# Altium schematic sheet schepc2.SchDoc
size A3; Author: *QUOCKHANH; DrawnBy: * NHÓM 17; SheetNumber: 1; SheetTotal: 1
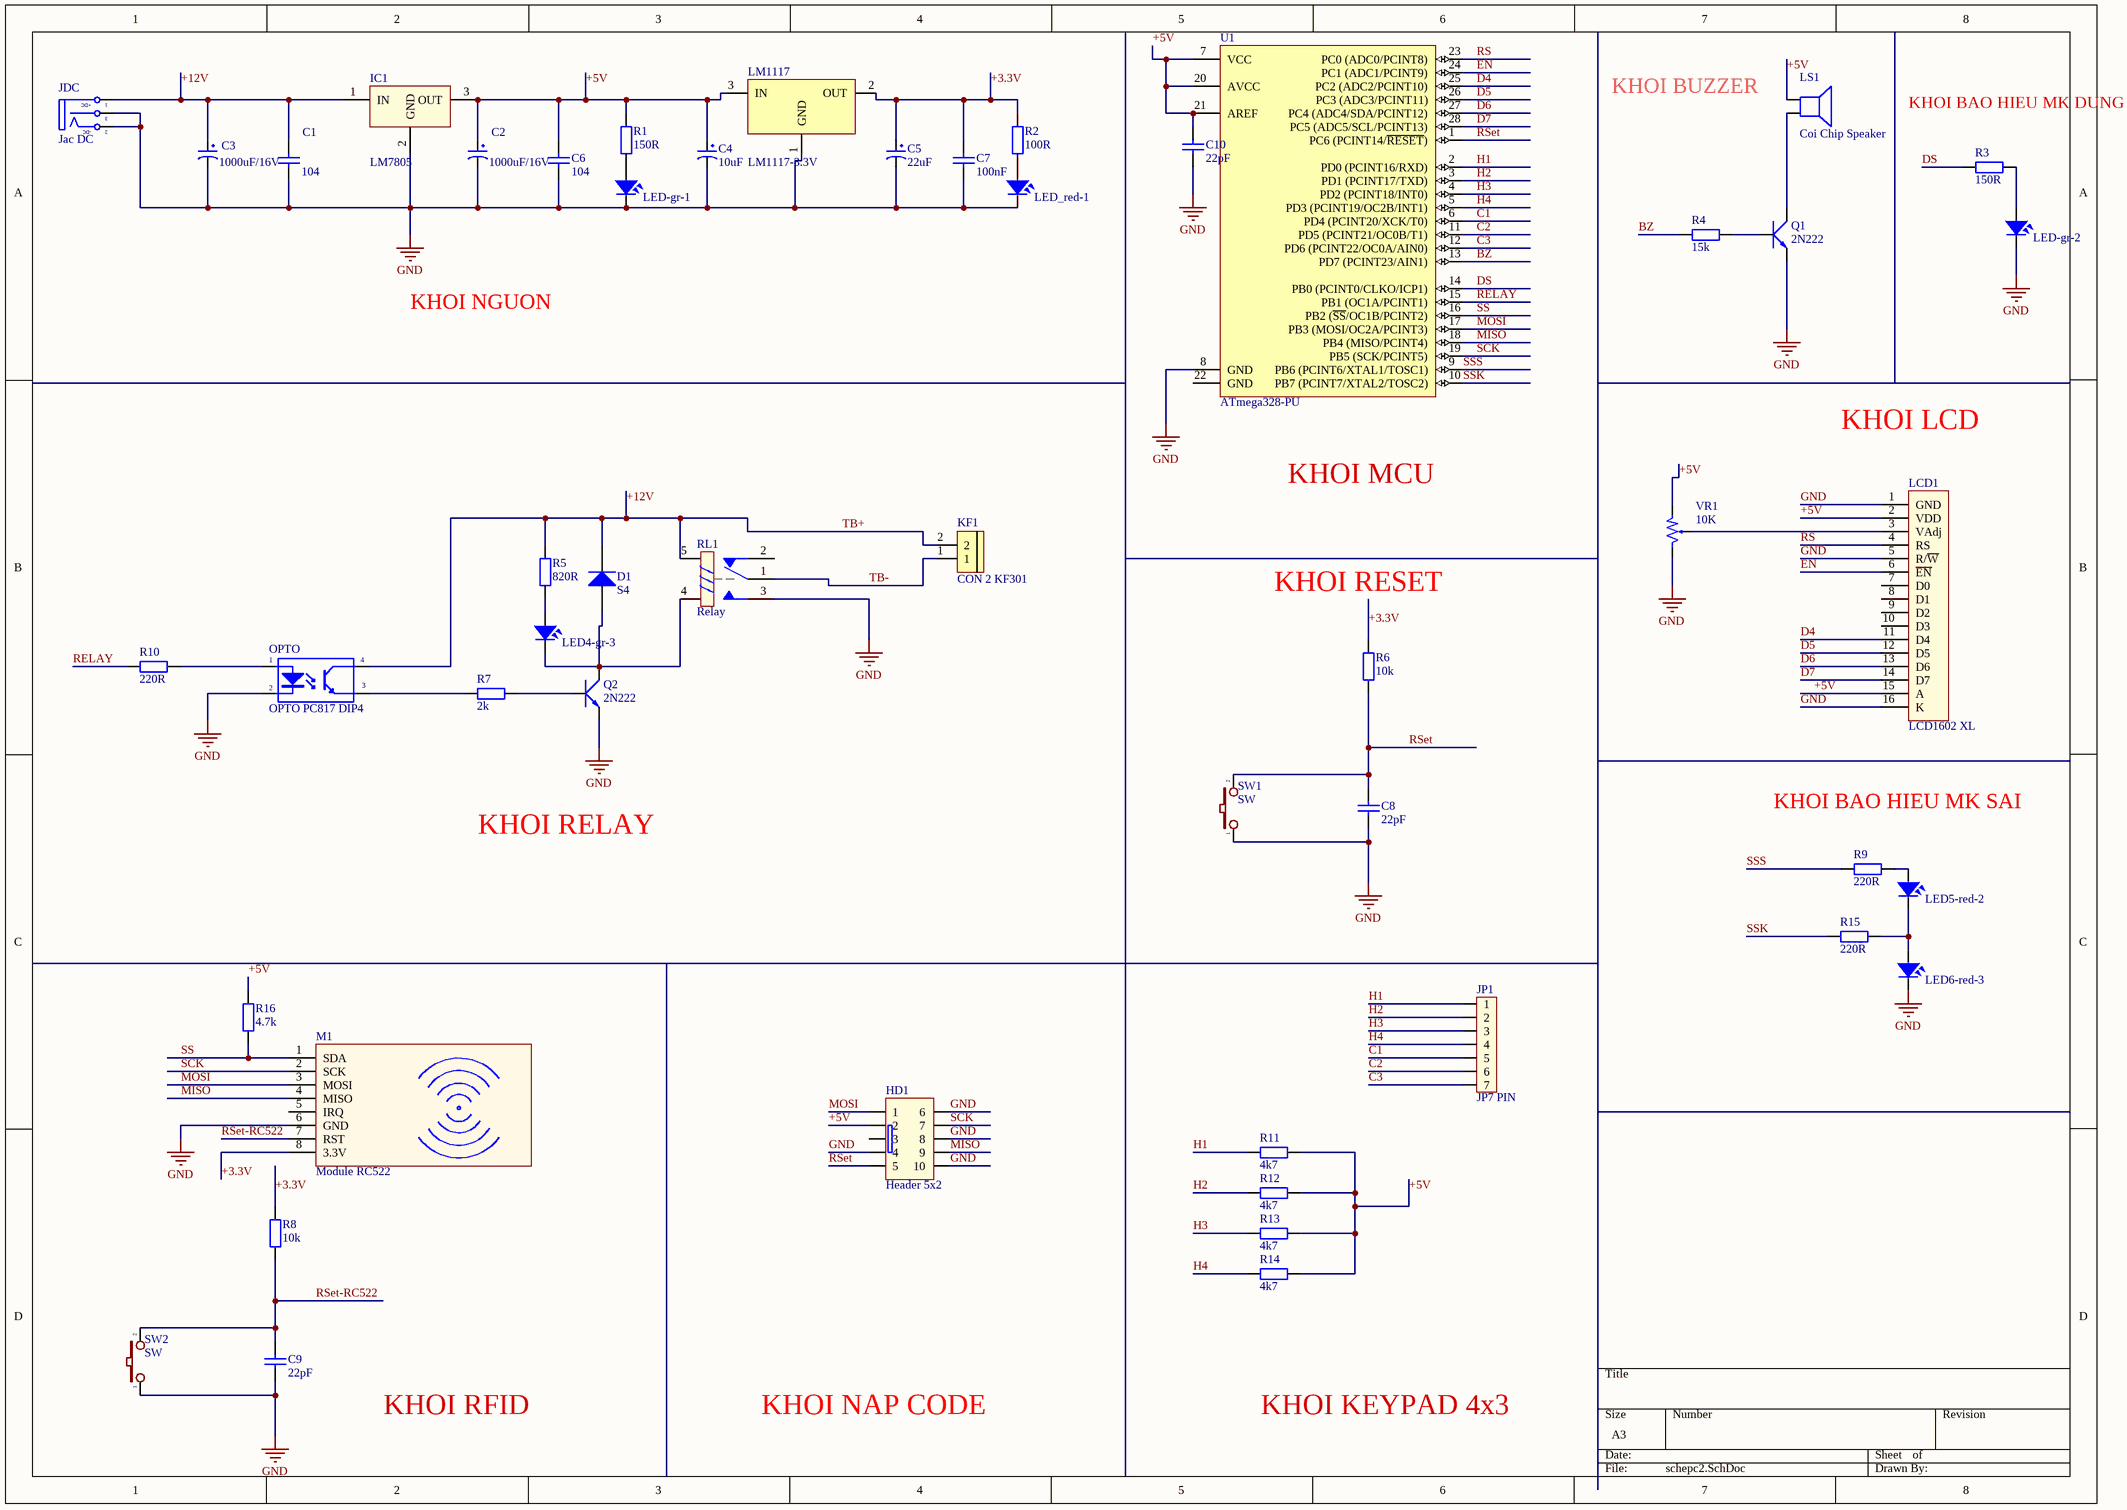
[diagram p0: schepc2.SchDoc]

## Parts
C1  104  [tu gom]
C2  1000uF/16V  [CP1.5/3.4]
C3  1000uF/16V  [CP1.5/3.4]
C4  10uF  [tu hoa 13mm]
C5  22uF  [tu hoa 5mm]
C6  104  [tu gom]
C7  100nF  [tu tantalum dip5.08]
C8  22pF  [tu gom]
C9  22pF  [tu gom]
C10  22pF  [tu gom]
D1  S4  [DIODE SOD-123]
HD1  Header 5x2  [Hed2X5]
IC1  LM7805  [QTO-220]
JDC  Jac DC  [DC-IN]
JP1  JP7 PIN  [JP7]
KF1  CON 2 KF301  [Con 2 KF301 5.08]
LCD1  LCD1602 XL  [LCD1602 with Jump]
LED4-gr-3  LED  [LED-5-Green]  (value not drawn)
LED5-red-2  LED  [LED-5MM-ORANGE]  (value not drawn)
LED6-red-3  LED  [LED-5MM-RED]  (value not drawn)
LED-gr-1  LED  [LED-5-Green]  (value not drawn)
LED-gr-2  LED  [LED-5-Green]  (value not drawn)
LED_red-1  LED  [LED-5-BLUE]  (value not drawn)
LM1117  LM1117-3.3V  [TO220-123]
LS1  Coi Chip Speaker  [Coi Chip Speacker]
M1  Module RC522  [Module RC522]
OPTO  OPTO PC817 DIP4  [DIP4]
Q1  2N222  [TO92-123]
Q2  2N222  [TO92-123]
R1  150R  [tro vach 1w]
R2  100R  [tro vach 1w]
R3  150R  [tro vach 1w]
R4  15k  [tro vach 1/4w]
R5  820R  [tro vach 1w]
R6  10k  [tro vach 1/4w]
R7  2k  [tro vach 1/4w]
R8  10k  [tro vach 1/4w]
R9  220R  [tro vach 1w]
R10  220R  [tro vach 1/4w]
R11  4k7  [tro vach 1/4w]
R12  4k7  [tro vach 1/4w]
R13  4k7  [tro vach 1/4w]
R14  4k7  [tro vach 1/4w]
R15  220R  [tro vach 1w]
R16  4.7k  [tro vach 1w]
RL1  Relay  [Relay 5 Chan SRD]
SW1  SW  [SW-DIP1]
SW2  SW  [SW-DIP1]
U1  ATmega328-PU  [DIP28]
VR1  10K  [VR]

## Nets
GND: C1.2 C2.2 C3.2 C4.2 C5.2 C6.2 C7.2 C8.2 C9.2 C10.2 HD1.4 HD1.6 HD1.8 HD1.10 IC1.2(GND) JDC.2(TN) JDC.3(S) LCD1.1(GND) LCD1.5(R/~{W}) LCD1.16(K) LED6-red-3.2 LED-gr-1.2 LED-gr-2.2 LED_red-1.2 LM1117.1(GND) M1.6(GND) OPTO.2(K) Q1.1(E) Q2.1(E) RL1.3 SW1.1 SW2.1 U1.8(GND) VR1.3
+3.3V: C5.1 C7.1 LM1117.2(OUT) M1.8(3.3V) R2.2 R6.2 R8.2
+5V: C2.1 C4.1 C6.1 C10.1 HD1.2 IC1.3(OUT) LCD1.2(VDD) LCD1.15(A) LM1117.3(IN) LS1.1 R1.2 R11.2 R12.2 R13.2 R14.2 R16.2 U1.7(VCC) U1.20(AVCC) U1.21(AREF) VR1.1
+12V: C1.1 C3.1 D1.2(K) IC1.1(IN) JDC.1(T) KF1.2 OPTO.4(C) R5.2 RL1.5  [also labelled TB+]
BZ: R4.1 U1.13(PD7_(PCINT23/AIN1))
C1: JP1.5 U1.6(PD4_(PCINT20/XCK/T0))
C2: JP1.6 U1.11(PD5_(PCINT21/OC0B/T1))
C3: JP1.7 U1.12(PD6_(PCINT22/OC0A/AIN0))
D4: LCD1.11(D4) U1.25(PC2_(ADC2/PCINT10))
D5: LCD1.12(D5) U1.26(PC3_(ADC3/PCINT11))
D6: LCD1.13(D6) U1.27(PC4_(ADC4/SDA/PCINT12))
D7: LCD1.14(D7) U1.28(PC5_(ADC5/SCL/PCINT13))
DS: R3.2 U1.14(PB0_(PCINT0/CLKO/ICP1))
EN: LCD1.6(~{EN}) U1.24(PC1_(ADC1/PCINT9))
H1: JP1.1 R11.1 U1.2(PD0_(PCINT16/RXD))
H2: JP1.2 R12.1 U1.3(PD1_(PCINT17/TXD))
H3: JP1.3 R13.1 U1.4(PD2_(PCINT18/INT0))
H4: JP1.4 R14.1 U1.5(PD3_(PCINT19/OC2B/INT1))
MISO: HD1.9 M1.4(MISO) U1.18(PB4_(MISO/PCINT4))
MOSI: HD1.1 M1.3(MOSI) U1.17(PB3_(MOSI/OC2A/PCINT3))
RELAY: R10.1 U1.15(PB1_(OC1A/PCINT1))
RS: LCD1.4(RS) U1.23(PC0_(ADC0/PCINT8))
RSet: C8.1 HD1.5 R6.1 SW1.2 U1.1(PC6_(PCINT14/~{RESET}))
RSet-RC522: C9.1 M1.7(RST) R8.1 SW2.2
SCK: HD1.7 M1.2(SCK) U1.19(PB5_(SCK/PCINT5))
SS: M1.1(SDA) R16.1 U1.16(PB2_(~{SS}/OC1B/PCINT2))
SSK: R15.1 U1.10(PB7_(PCINT7/XTAL2/TOSC2))
SSS: R9.1 U1.9(PB6_(PCINT6/XTAL1/TOSC1))
TB-: KF1.1 RL1.1
NetD1_1: D1.1(A) LED4-gr-3.2 Q2.3(C) RL1.4
NetLCD1_3: LCD1.3(VAdj) VR1.2
NetLED4-gr-3_1: LED4-gr-3.1 R5.1
NetLED5-red-2_1: LED5-red-2.1 R9.2
NetLED5-red-2_2: LED5-red-2.2 LED6-red-3.1 R15.2
NetLED-gr-1_1: LED-gr-1.1 R1.1
NetLED-gr-2_1: LED-gr-2.1 R3.1
NetLED_red-1_1: LED_red-1.1 R2.1
NetLS1_2: LS1.2 Q1.3(C)
NetOPTO_1: OPTO.1(A) R10.2
NetOPTO_3: OPTO.3(E) R7.1
NetQ1_2: Q1.2(B) R4.2
NetQ2_2: Q2.2(B) R7.2

Not connected (* = marked no-connect by the designer): HD1 3; LCD1 7(D0) 8(D1) 9(D2) 10(D3); M1 5(IRQ); RL1 2; U1 22(GND)

## Notes on the sheet
- KHOI BUZZER
- KHOI BAO HIEU MK DUNG
- KHOI NGUON
- KHOI LCD
- KHOI MCU
- KHOI RESET
- KHOI RELAY
- KHOI BAO HIEU MK SAI
- KHOI RFID
- KHOI NAP CODE
- KHOI KEYPAD 4x3
- (in symbol DCIN) +DC; -DC

## Library data of the parts
C1 C6 = Tu gom 104 50V: Cắm; So_Chan: 2; Ten_Linh_Kien: Tụ gốm 104 100nF 50V; Don_Vi: Con; Ma_Hang: MH004761; Chung_Loai: Cắm; Kieu_Chan: *
C2 C3 = CP4: Cap 1000uF/16V - 220uF/50V; Description 5: 4,7uF>10uF/250V_3,3uF>10uF/400V - 2,2uF>4,7uF/450V; Description 1: 2200uF-3300uF/6,3V - 1000uF-2200uF/10V; Description 2: 1000uF/16V - 470uF => 1000uF/25V - 100uF/100V; Description 3: 330uF>470uF/35V_220uF>470uF/50V_10uF>22uF/250V; Description 4: 220uF => 330uF/63V - 10uF =>33uF/160 - 200V; Value: 1000uF/16V
C4 = Tu Hoa 10uF 450V 13x20: Cắm; Don_Vi: Con; So_Chan: 2; Ten_Linh_Kien: Tụ Hóa 10uF 450V 13x20MM; Ma_Hang: MH003950; Chung_Loai: Cắm; Kieu_Chan: *
C5 = Tu Hoa 22uF 25V 5x11: Cắm; So_Chan: 2; Don_Vi: Con; Ten_Linh_Kien: Tụ Hóa 22uF 25V; Ma_Hang: MH006858; Chung_Loai: Cắm; Kieu_Chan: *
C7 = Tu tantalum 100nF 50V 20% DIP5.08: Cắm; Don_Vi: Con; So_Chan: 2; Ten_Linh_Kien: Tụ tantalum 104-100nF 50V 20% DIP5.08 (sứ vàng)(10PCS); Ma_Hang: MH003955; Chung_Loai: Cắm; Kieu_Chan: *
C8-C10 = Tu gom 22pF 50V: Cắm; Don_Vi: Con; So_Chan: 2; Ten_Linh_Kien: Tụ gốm 22P 50V; Ma_Hang: MH004771; Chung_Loai: Cắm; Kieu_Chan: *
D1 = Diode S4: Dán; Ten_Linh_Kien: Diode S4 SOD123 ( 1N5819 SOD123); Ma_Hang: MH005519; Don_Vi: Con; Ghi_Chu: *; Chung_Loai: Dán; Kieu_Chan: *
HD1 = HED5x2: Value: Header 5x2
IC1 = LM78xx: On ap +, from + 5 to + 24VDC; Value: LM7805
JDC = DCIN: Jac DC input; Value: Jac DC
JP1 = JP7: Value: JP7
KF1 = CON 2 KF301: Cắm; Ma_Hang: MH000987; Ten_Linh_Kien: CON 2 KF301-2P 5.08MM Xanh Dương; Chung_Loai: Cắm; Ghi_Chu: *; Kieu_Chan: *; Don_Vi: Con
LCD1 = LCD1602 XL: LCD 1602 Xanh Lá; Ten: Màn hình LCD 1602 Xanh Lá; Ma_Hang: 67HZ; NCC: NSHOP; CHIP: HD44780
LED4-gr-3 LED5-red-2 LED6-red-3 LED-gr-1 LED-gr-2 LED_red-1 = LED: LED Single colour Green and Red; Value: LED 3 ly Single Colour
LM1117 = LM1117: 800mA Low-Dropout Linear Regulator; Creator: Nguyen Ba Bien; Website: http://group3i.net
LS1 = Coi Chip Speaker: Còi chip
OPTO = OPTO PC817 DIP4: Single Opto; Value: PC817
Q1 Q2 = 2N222: NPN 600mW, ECB; Value: C1815
R1 R3 = Tro Vach 1W 5% 150R: Cắm; Don_Vi: Con; So_Chan: 2; Ten_Linh_Kien: Trở 5% 1w 150R; Ma_Hang: MH006395; Chung_Loai: Cắm; Kieu_Chan: *
R2 = Tro Vach 1W 5% 100R: Cắm; Don_Vi: Con; So_Chan: 2; Ten_Linh_Kien: Trở 5% 1w 100R; Ma_Hang: MH006390; Chung_Loai: Cắm; Kieu_Chan: *
R4 = Tro Vach 1/4W 5% 15k: Cắm; Don_Vi: Con; So_Chan: 2; Ten_Linh_Kien: Trở Vạch 1/4w 5% 15k; Ma_Hang: MH007288; Chung_Loai: Cắm; Kieu_Chan: *
R5 = Tro Vach 1W 5% 820R: Cắm; Don_Vi: Con; So_Chan: 2; Ten_Linh_Kien: Trở 5% 1w 820R; Ma_Hang: MH006413; Kieu_Chan: *; Chung_Loai: Cắm
R6 = Tro Vach 1/4W 1% 10k: Cắm; Don_Vi: Con; So_Chan: 2; Ten_Linh_Kien: Trở Vạch 1/4w 1% 10k; Ma_Hang: MH006349; Chung_Loai: Cắm; Kieu_Chan: *
R7 = Tro Vach 1/4W 5% 2k: Cắm; Don_Vi: Con; So_Chan: 2; Ten_Linh_Kien: Trở Vạch 1/4w 5% 2k; Ma_Hang: MH007305; Chung_Loai: Cắm; Kieu_Chan: *
R8 = Tro Vach 1/4W 5% 10k: Căm; Chung_Loai: Cắm; Don_Vi: Con; So_Chan: 2; Ten_Linh_Kien: Trở Vạch 1/4w 5% 10K; Ma_Hang: MH007354; Kieu_Chan: *
R9 R15 = Tro Vach 1W 5% 220R: Cắm; Don_Vi: Con; So_Chan: 2; Ten_Linh_Kien: Trở 5% 1w 220R; Ma_Hang: MH006414; Chung_Loai: Cắm; Kieu_Chan: *
R10 = Tro Vach 1/4W 5% 220R: Cắm; Don_Vi: Con; So_Chan: 2; Ten_Linh_Kien: Trở Vạch 1/4w 5% 220R; Ma_Hang: MH007300; Chung_Loai: Cắm; Kieu_Chan: *
R11-R14 = Tro Vach 1/4W 5% 470R: Cắm; Don_Vi: Con; So_Chan: 2; Ten_Linh_Kien: Trở Vạch 1/4w 5% 470R; Ma_Hang: MH007320; Chung_Loai: Cắm; Kieu_Chan: *
R16 = Tro Vach 1W 5% 4.7k: Cắm; Don_Vi: Con; So_Chan: 2; Ten_Linh_Kien: Trở 5% 1w 4.7k; Ma_Hang: MH006407; Chung_Loai: Cắm; Kieu_Chan: *
RL1 = Relay 5 Chan SRD: Relay 5 Chan; Ma_Hang: MH009374; Ten: Relay 5V10A SRD-05VDC-SL-C Chính Hãng
SW1 SW2 = SW2: Switch button 2 pin; Value: SW chip 2 pin
U1 = ATmega328-PU: 8-bit AVR Microcontroller, 32KB Flash, 1KB EEPROM, 2KB SRAM, 28-pin PDIP, Industrial Grade (-40°C to 85°C); Published: 1-Apr-2010; DatasheetVersion: revA, Jan-2010; PackageVersion: revB, Sep-2001; PackageReference: 28P3; Publisher: Altium Limited; PackageDescription: 28-lead (0.300"/7.62mm Wide) Plastic Dual Inline Package (PDIP); Supplier 1: Digi-Key; Supplier Part Number 1: ATMEGA328-PU-ND; Supplier 2: Mouser; Supplier Part Number 2: 556-ATMEGA328-PU; ComponentLink1Description: Manufacturer Link; ComponentLink1URL: http://www.atmel.com/products/avr/default.asp?; ComponentLink2Description: ATmega48A/48PA/88A/88PA/168A/168PA/328/328P Datasheet; ComponentLink2URL: http://www.atmel.com/dyn/resources/prod_documents/8271.pdf; ComponentLink3Description: ATmega48A/48PA/88A/88PA/168A/168PA/328/328P Summary; ComponentLink3URL: http://www.atmel.com/dyn/resources/prod_documents/8271S.pdf; ComponentLink4Description: Atmel.com Home; ComponentLink4URL: http://www.atmel.com
VR1 = VR1: Var Resistor; Value: VR 10K